# Altium project Harness_ETRX.PrjPcb
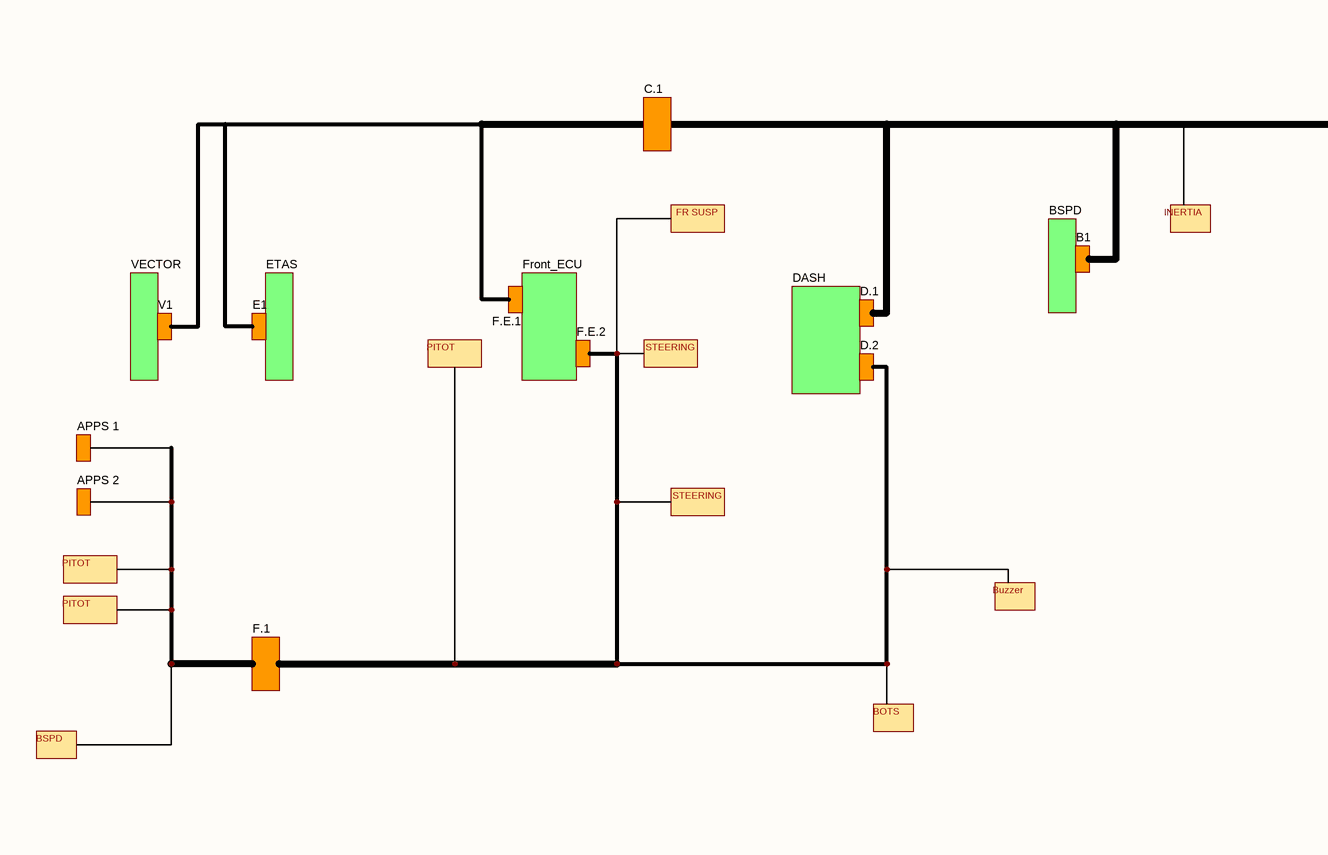
[diagram p0: Esquema_gen_ETRX.SchDoc, left]
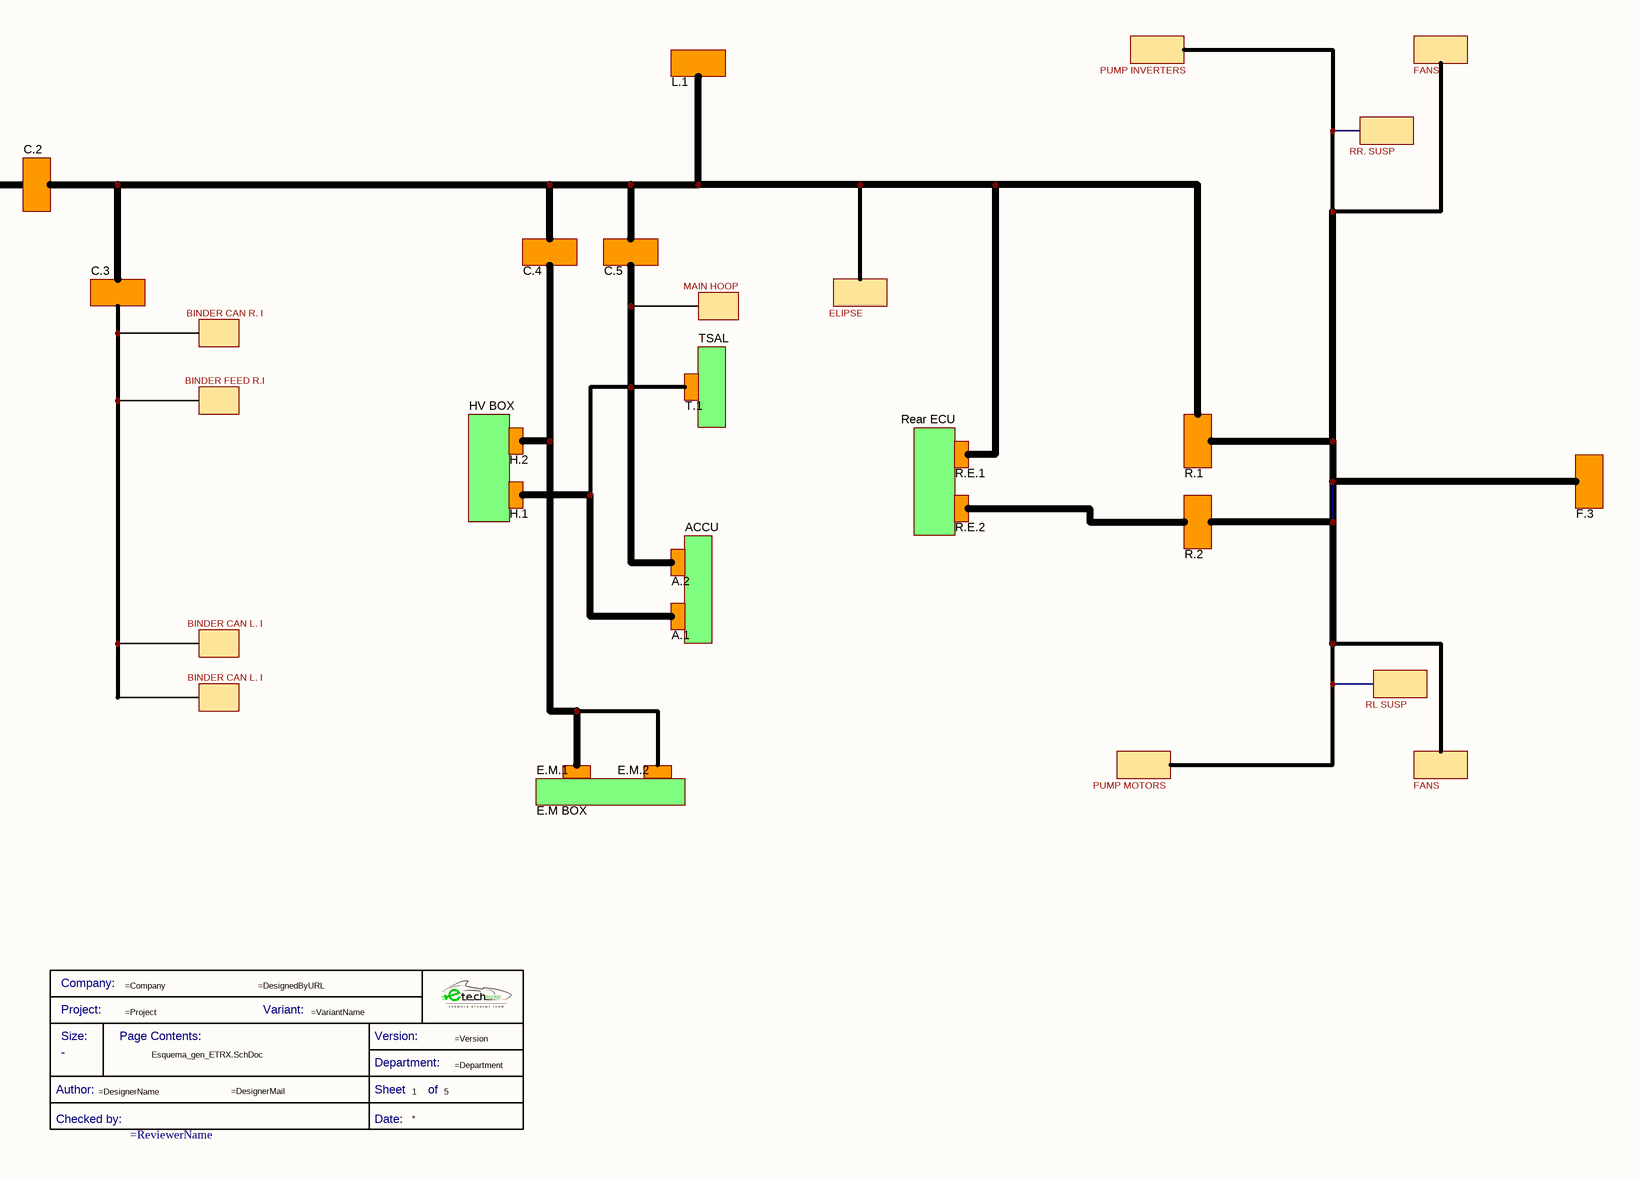
[diagram p1: Esquema_gen_ETRX.SchDoc, right]
12 sheets, 7 parts. Net scope: hierarchical (ports join the sheet entries above them; power ports are global).
Sheets:
  Esquema_gen_ETRX.SchDoc
    Jose maricon = Front_ECU.SchDoc
    Designator = Rear ECU.SchDoc
    Designator = HV BOX.SchDoc
    Designator = DASH.SchDoc
    Designator = E.M BOX.SchDoc
    Designator = ACCU.SchDoc
    Designator = ETAS.SchDoc
    Designator = VECTOR.SchDoc
    Designator = BSPD.SchDoc
  FRONT SENSORS.SchDoc
  Esquema cableado gen.SchDoc
    Designator = DASH.SchDoc
    Designator = Front_ECU.SchDoc
    Designator = ETAS.SchDoc
    Designator = HV BOX.SchDoc
    Designator = ACCU.SchDoc
    Designator = Rear ECU.SchDoc

## Sheet Esquema_gen_ETRX.SchDoc
size 599 x 241 mm; SheetNumber: 1; SheetTotal: 5

### Parts
*  Title Block_template  (value not drawn)  (graphical)

### Sub-sheets
Designator = Rear ECU: no entries
Designator = HV BOX: no entries
Designator = DASH: no entries
Designator = E.M BOX: no entries
Designator = ACCU: no entries
Designator = ETAS: no entries
Designator = VECTOR: no entries
Designator = BSPD: no entries
Designator = TSAL (file not in this document): no entries
Designator = F.E.2 (file not in this document): no entries
Designator = F.E.1 (file not in this document): no entries
Designator = V1 (file not in this document): no entries
Designator = E1 (file not in this document): no entries
Designator = B1 (file not in this document): no entries
Designator = D.1 (file not in this document): no entries
Designator = D.2 (file not in this document): no entries
Designator = APPS 1 (file not in this document): no entries
Designator = APPS 2 (file not in this document): no entries
Designator = C.1 (file not in this document): no entries
Designator = F.1 (file not in this document): no entries
Designator = C.2 (file not in this document): no entries
Designator = C.3 (file not in this document): no entries
Designator = C.4 (file not in this document): no entries
Designator = C.5 (file not in this document): no entries
Designator = H.2 (file not in this document): no entries
Designator = H.1 (file not in this document): no entries
Designator = A.2 (file not in this document): no entries
Designator = A.1 (file not in this document): no entries
Designator = T.1 (file not in this document): no entries
Designator = E.M.1 (file not in this document): no entries
Designator = E.M.2 (file not in this document): no entries
Designator = L.1 (file not in this document): no entries
Designator = R.E.1 (file not in this document): no entries
Designator = R.E.2 (file not in this document): no entries
Designator = R.1 (file not in this document): no entries
Designator = R.2 (file not in this document): no entries
Designator = F.3 (file not in this document): no entries
Jose maricon = Front_ECU: no entries

### Notes on the sheet
- PUMP INVERTERS
- FANS
- RR. SUSP
- FR SUSP
- INERTIA
- BINDER CAN R. I
- MAIN HOOP
- ELIPSE
- BINDER FEED R.I
- PITOT
- STEERING
- Buzzer
- BINDER CAN L. I
- RL SUSP
- BOTS
- PUMP MOTORS
- BSPD
- (in symbol Title Block_template) Company:; Project:; Variant:; Size:; Page Contents:; Version:; Department:; Author:; Sheet; of; Checked by:; Date:

### Library data of the parts
* = Title Block_template: Standard Title Block; .Creator: GP; Category: Title Block; .PCBcheck: GP; .SCHcheck: GP; Checked by:: =ReviewerName; Size: -

## Sheet Front_ECU.SchDoc
size A4
Used 2 times, as channels Jose maricon, Designator. Parts and nets are listed once, with the designators drawn on the sheet.
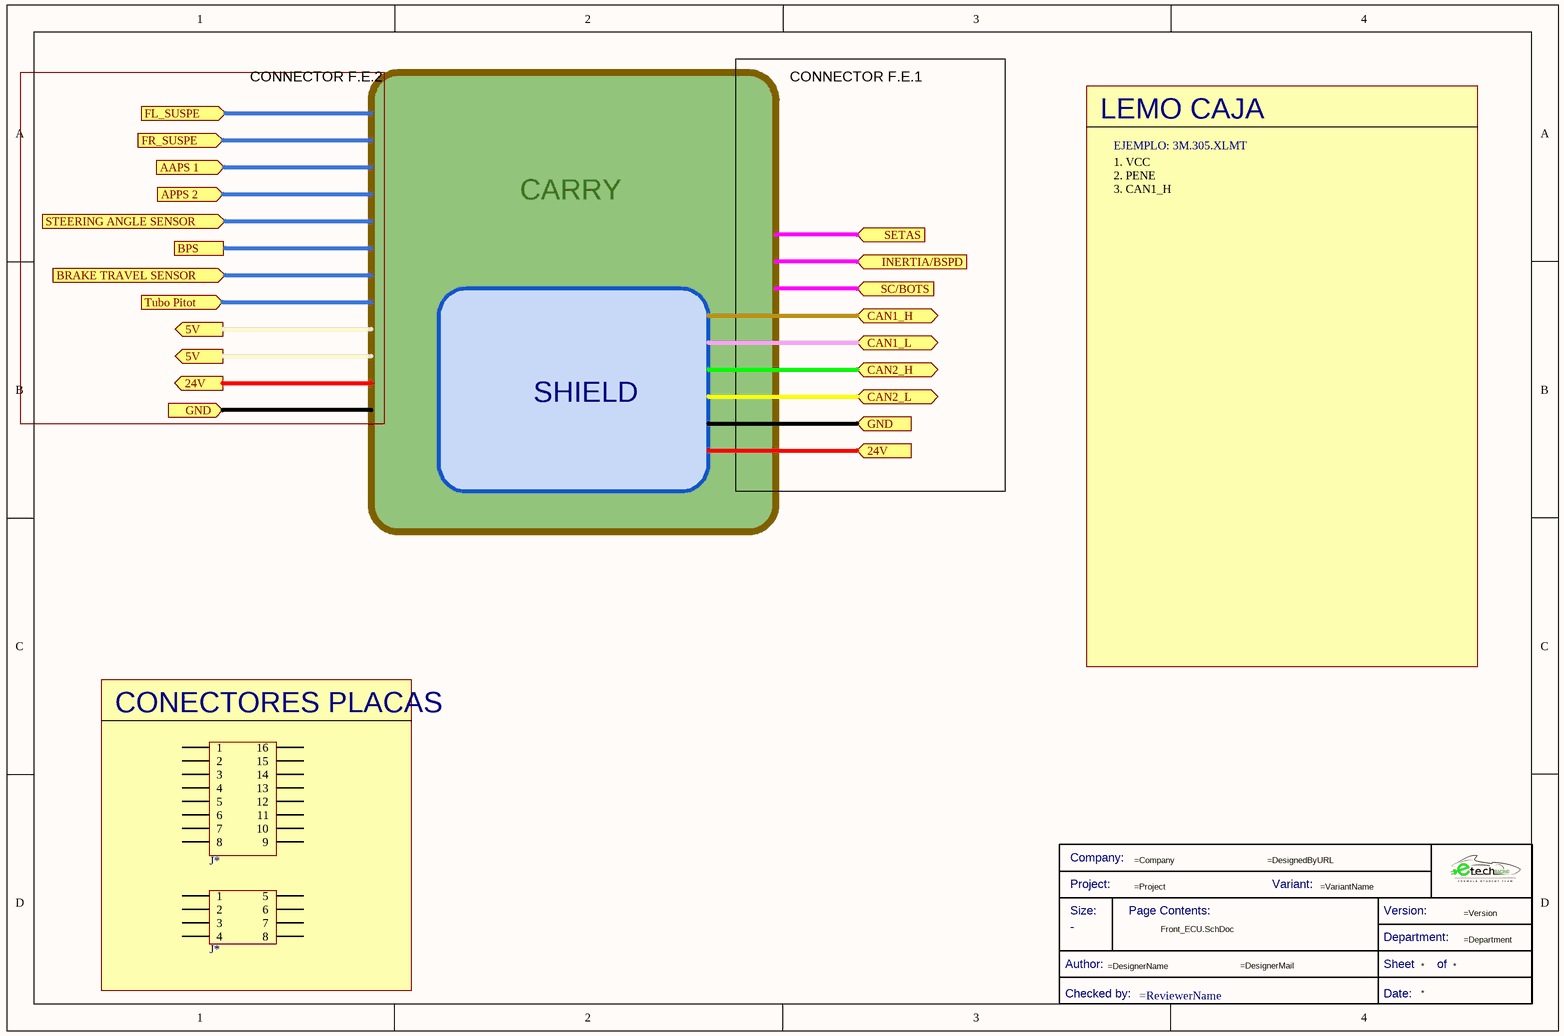
[diagram p2: Front_ECU.SchDoc]

### Parts
(Parts that share a designator on the sheet are numbered #1, #2 ... from top to bottom, then left to right.)
*?  Title Block_template  (value not drawn)  (graphical)
J*#1  1053141116  [J_NanoFit_2x8]  (value not drawn)
J*#2  0430450800  [J_MicroFit_2x4]  (value not drawn)

### Blocks framed on the sheet
CONECTORES PLACAS: J*#1 J*#2

### Ports
5V (out), 24V (in), 24V (out), AAPS 1 (in), APPS 2 (in), BPS (in), BRAKE TRAVEL SENSOR (in), CAN1_H (bidir), CAN1_L (bidir), CAN2_H (bidir), CAN2_L (bidir), FL_SUSPE (in), FR_SUSPE (in), GND (in), INERTIA/BSPD (in), SC/BOTS (in), SETAS (in), STEERING ANGLE SENSOR (in), Tubo Pitot (in)

### Nets

Not connected (* = marked no-connect by the designer): J*#1 1 2 3 4 5 6 7 8 9 10 11 12 13 14 15 16; J*#2 1 2 3 4 5 6 7 8

### Channels
Jose maricon: designators *?=*?_Jose_maricon J*=J*_Jose_maricon#1 J*=J*_Jose_maricon#2; ports 5V=open 24V=open AAPS 1=open APPS 2=open BPS=open BRAKE TRAVEL SENSOR=open CAN1_H=open CAN1_L=open CAN2_H=open CAN2_L=open FL_SUSPE=open FR_SUSPE=open GND=open INERTIA/BSPD=open SC/BOTS=open SETAS=open STEERING ANGLE SENSOR=open Tubo Pitot=open
Designator: designators *?=*?_Designator J*=J*_Designator#1 J*=J*_Designator#2; ports 5V=open 24V=open AAPS 1=open APPS 2=open BPS=open BRAKE TRAVEL SENSOR=open CAN1_H=open CAN1_L=open CAN2_H=open CAN2_L=open FL_SUSPE=open FR_SUSPE=open GND=open INERTIA/BSPD=open SC/BOTS=open SETAS=open STEERING ANGLE SENSOR=open Tubo Pitot=open

### Notes on the sheet
- CONNECTOR F.E.2
- CONNECTOR F.E.1
- LEMO CAJA
- EJEMPLO: 3M.305.XLMT
- CARRY
- 1. VCC          2. PENE        3. CAN1_H
- SHIELD
- (in symbol Title Block_template) Company:; Project:; Variant:; Size:; Page Contents:; Version:; Department:; Author:; Sheet; of; Checked by:; Date:

### Library data of the parts
*? = Title Block_template: Standard Title Block; .Creator: GP; Category: Title Block; .PCBcheck: GP; .SCHcheck: GP; Checked by:: =ReviewerName; Size: -
J*#1 = J_NanoFit_2x8: Nano-Fit Right Angle Header Through Hole 2.50mm Pitch Dual Row 16 Circuits Tin (Sn) Plating Black; Manufacturer: Molex; Manufacturer Part Number: 105314-1116; .Creator: DO; ComponentLink1URL: https://www.molex.com/pdm_docs/ps/PS-105300-100-001.pdf?src-supplier=Digi-Key; ComponentLink1Description: https://www.molex.com/pdm_docs/ps/PS-105300-100-001.pdf?src-supplier=Digi-Key; ComponentLink2Description: Where buy it; ComponentLink2URL: https://www.molex.com/molex/products/part-detail/pcb_headers/1053141116; Supplier 1: Newark; RoHS: Yes; Category: Headers and Wire Housings; Stock 1: 366; Pricing 1: 1=3,37000, 10=3,24000, 25=2,88000, 50=2,81000, 100=2,73000, 250=2,44000 (USD); Supplier Part Number 1: 33AC7692
J*#2 = J_MicroFit_2x4: Connector Wire to Board Header 8 Position 3mm Solder Right Angle Thru-Hole Tray; Manufacturer 1: Molex; .Creator: GP; Supplier 1: Arrow Electronics; Manufacturer Part Number 1: 0430450800; RoHS: Yes; Category: Headers and Wire Housings; Stock 1: 47494; Pricing 1: 1=2,57150, 10=2,34190, 25=2,14460, 50=2,00330, 100=1,89490, 500=1,75400 (USD); Supplier Part Number 1: 43045-0800

## Sheet Rear ECU.SchDoc
size A4
Used 2 times, as channels Designator, Designator. Parts and nets are listed once, with the designators drawn on the sheet.
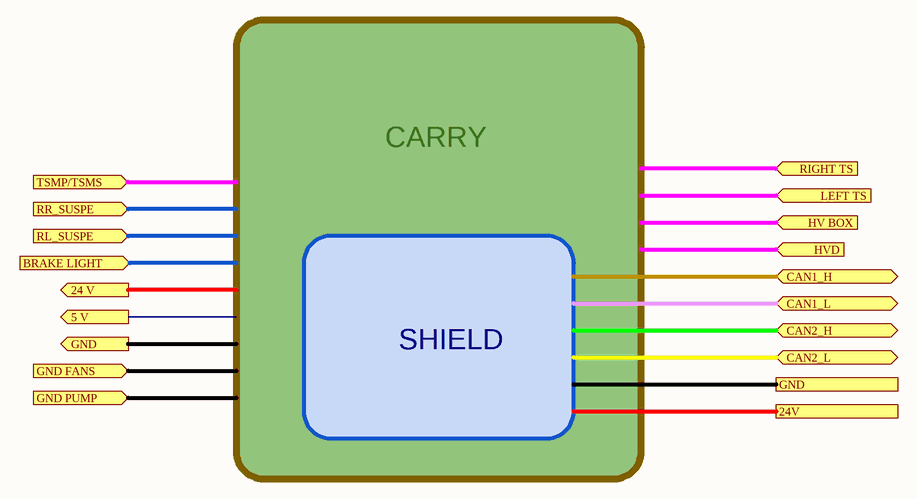
[diagram p3: Rear ECU.SchDoc]

### Ports
5 V (out), 24 V (out), 24V, BRAKE LIGHT (in), CAN1_H (bidir), CAN1_L (bidir), CAN2_H (bidir), CAN2_L (bidir), GND, GND (out), GND FANS (in), GND PUMP (in), HV BOX (in), HVD (in), LEFT TS (in), RIGHT TS (in), RL_SUSPE (in), RR_SUSPE (in), TSMP/TSMS (in)

### Channels
Designator: ports 5 V=open 24 V=open 24V=open BRAKE LIGHT=open CAN1_H=open CAN1_L=open CAN2_H=open CAN2_L=open GND FANS=open GND PUMP=open GND=open HV BOX=open HVD=open LEFT TS=open RIGHT TS=open RL_SUSPE=open RR_SUSPE=open TSMP/TSMS=open
Designator: ports 5 V=open 24 V=open 24V=open BRAKE LIGHT=open CAN1_H=open CAN1_L=open CAN2_H=open CAN2_L=open GND FANS=open GND PUMP=open GND=open HV BOX=open HVD=open LEFT TS=open RIGHT TS=open RL_SUSPE=open RR_SUSPE=open TSMP/TSMS=open

### Notes on the sheet
- CARRY
- SHIELD

## Sheet HV BOX.SchDoc
size 381 x 241 mm
Used 2 times, as channels Designator, Designator. Parts and nets are listed once, with the designators drawn on the sheet.
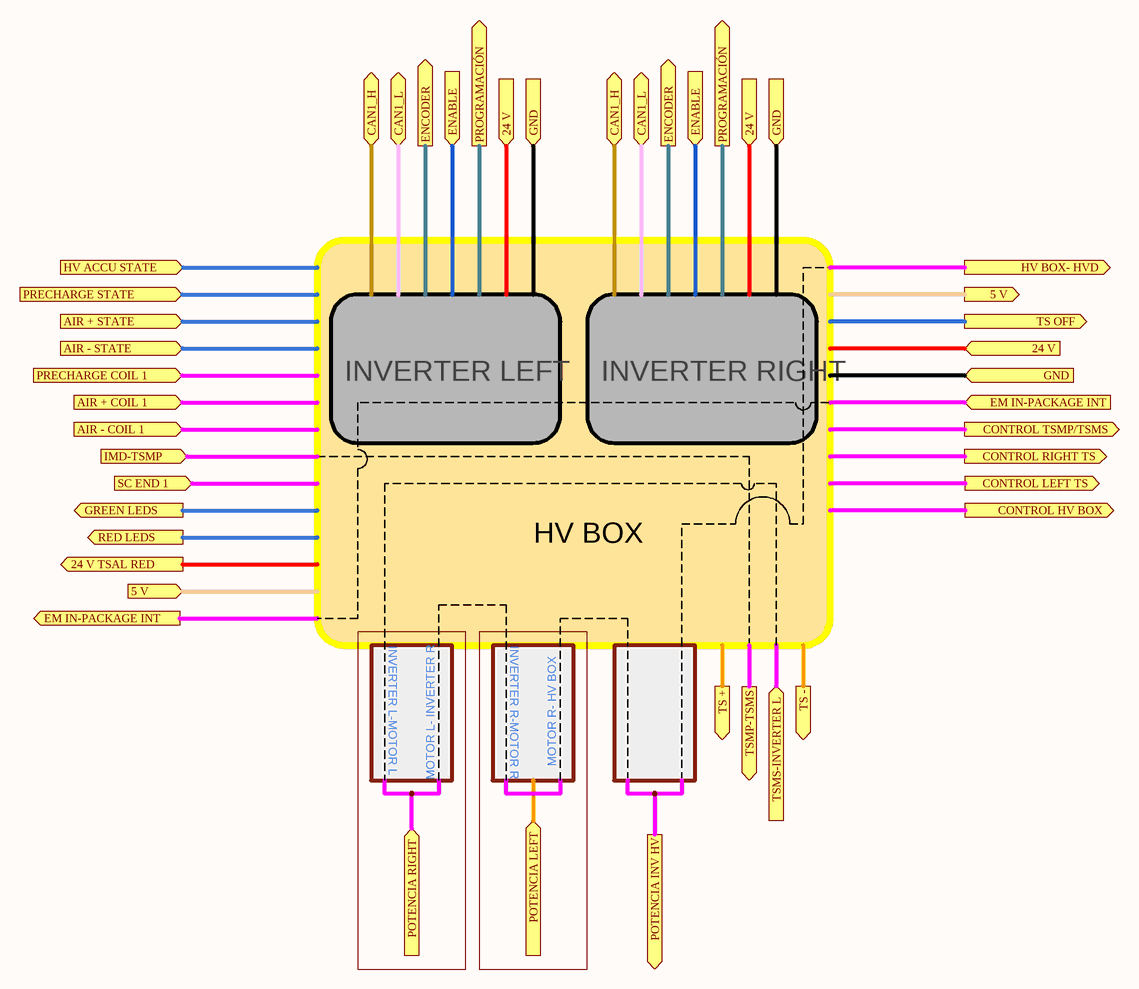
[diagram p4: HV BOX.SchDoc]

### Ports
5 V (in), 5 V (out), 24 V (in), 24 V TSAL RED (out), AIR + COIL 1 (in), AIR + STATE (in), AIR - COIL 1 (in), AIR - STATE (in), CAN1_H (bidir), CAN1_L (bidir), CONTROL HV BOX (out), CONTROL LEFT TS (out), CONTROL RIGHT TS (out), CONTROL TSMP/TSMS (out), EM IN-PACKAGE INT (in), EM IN-PACKAGE INT (out), ENABLE (in), ENCODER (out), GND (in), GREEN LEDS (out), HV ACCU STATE (in), HV BOX- HVD (out), IMD-TSMP (in), POTENCIA INV HV (out), POTENCIA LEFT (in), POTENCIA RIGHT (in), PRECHARGE COIL 1 (in), PRECHARGE STATE (in), PROGRAMACIÓN (out), RED LEDS (out), SC END 1 (in), TS + (out), TS - (out), TS OFF (out), TSMP-TSMS (out), TSMS-INVERTER L (in)

### Channels
Designator: ports 5 V=open 24 V TSAL RED=open 24 V=open AIR + COIL 1=open AIR + STATE=open AIR - COIL 1=open AIR - STATE=open CAN1_H=open CAN1_L=open CONTROL HV BOX=open CONTROL LEFT TS=open CONTROL RIGHT TS=open CONTROL TSMP/TSMS=open EM IN-PACKAGE INT=open ENABLE=open ENCODER=open GND=open GREEN LEDS=open HV ACCU STATE=open HV BOX- HVD=open IMD-TSMP=open POTENCIA INV HV=open POTENCIA LEFT=open POTENCIA RIGHT=open PRECHARGE COIL 1=open PRECHARGE STATE=open PROGRAMACIÓN=open RED LEDS=open SC END 1=open TS +=open TS -=open TS OFF=open TSMP-TSMS=open TSMS-INVERTER L=open
Designator: ports 5 V=open 24 V TSAL RED=open 24 V=open AIR + COIL 1=open AIR + STATE=open AIR - COIL 1=open AIR - STATE=open CAN1_H=open CAN1_L=open CONTROL HV BOX=open CONTROL LEFT TS=open CONTROL RIGHT TS=open CONTROL TSMP/TSMS=open EM IN-PACKAGE INT=open ENABLE=open ENCODER=open GND=open GREEN LEDS=open HV ACCU STATE=open HV BOX- HVD=open IMD-TSMP=open POTENCIA INV HV=open POTENCIA LEFT=open POTENCIA RIGHT=open PRECHARGE COIL 1=open PRECHARGE STATE=open PROGRAMACIÓN=open RED LEDS=open SC END 1=open TS +=open TS -=open TS OFF=open TSMP-TSMS=open TSMS-INVERTER L=open

### Notes on the sheet
- INVERTER LEFT
- INVERTER RIGHT
- HV BOX
- INVERTER L-MOTOR L
- INVERTER R-MOTOR R
- MOTOR R- HV BOX
- MOTOR L- INVERTER R

## Sheet DASH.SchDoc
size A4
Used 2 times, as channels Designator, Designator. Parts and nets are listed once, with the designators drawn on the sheet.
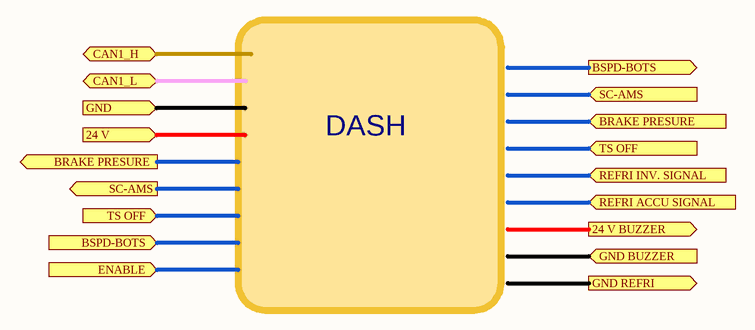
[diagram p5: DASH.SchDoc]

### Ports
24 V (in), 24 V BUZZER (out), BRAKE PRESURE  (in), BRAKE PRESURE  (out), BSPD-BOTS (in), BSPD-BOTS (out), CAN1_H (bidir), CAN1_L (bidir), ENABLE (in), GND (in), GND BUZZER (in), GND REFRI (out), REFRI ACCU SIGNAL (in), REFRI INV. SIGNAL (in), SC-AMS (in), SC-AMS (out), TS OFF (in)

### Channels
Designator: ports 24 V BUZZER=open 24 V=open BRAKE PRESURE =open BSPD-BOTS=open CAN1_H=open CAN1_L=open ENABLE=open GND BUZZER=open GND REFRI=open GND=open REFRI ACCU SIGNAL=open REFRI INV. SIGNAL=open SC-AMS=open TS OFF=open
Designator: ports 24 V BUZZER=open 24 V=open BRAKE PRESURE =open BSPD-BOTS=open CAN1_H=open CAN1_L=open ENABLE=open GND BUZZER=open GND REFRI=open GND=open REFRI ACCU SIGNAL=open REFRI INV. SIGNAL=open SC-AMS=open TS OFF=open

### Notes on the sheet
- DASH

## Sheet E.M BOX.SchDoc
size A4; SheetNumber: 5; SheetTotal: 6
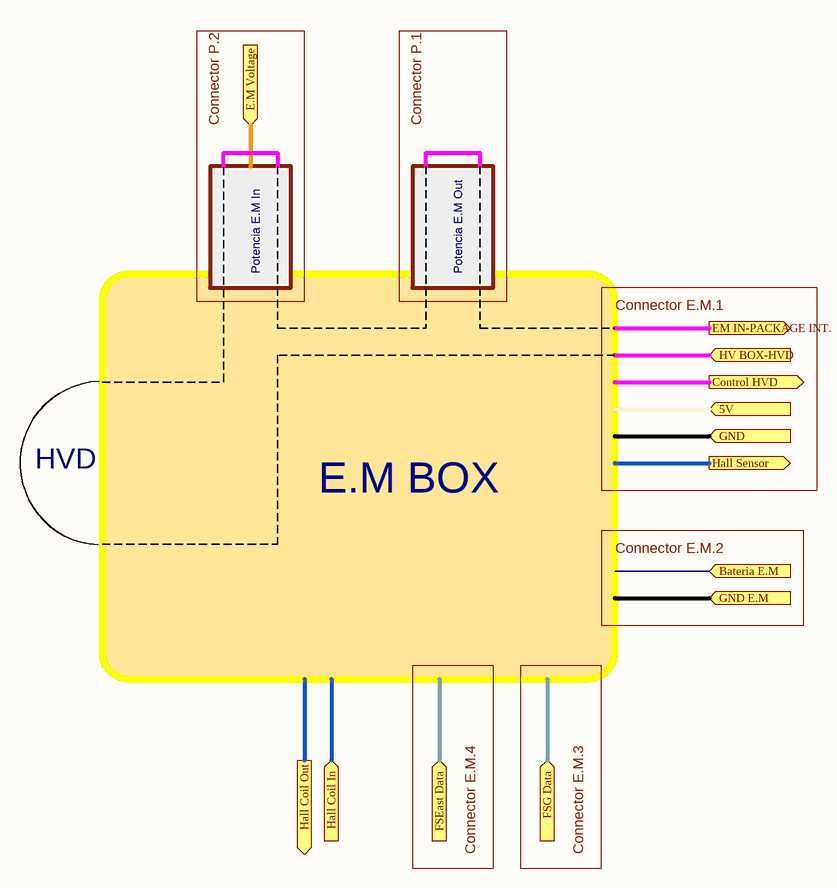
[diagram p6: E.M BOX.SchDoc]

### Ports
5V (in), Bateria E.M (in), Control HVD (out), E.M Voltage (in), EM IN-PACKAGE INT. (out), FSEast Data (in), FSG Data (in), GND (in), GND E.M (in), Hall Coil In (in), Hall Coil Out (out), Hall Sensor (out), HV BOX-HVD (in)

### Notes on the sheet
- Connector P.2
- Connector P.1
- Potencia E.M In
- Potencia E.M Out
- Connector E.M.1
- HVD
- E.M BOX
- Connector E.M.2
- Connector E.M.4
- Connector E.M.3

## Sheet ACCU.SchDoc
size A2
Used 2 times, as channels Designator, Designator. Parts and nets are listed once, with the designators drawn on the sheet.
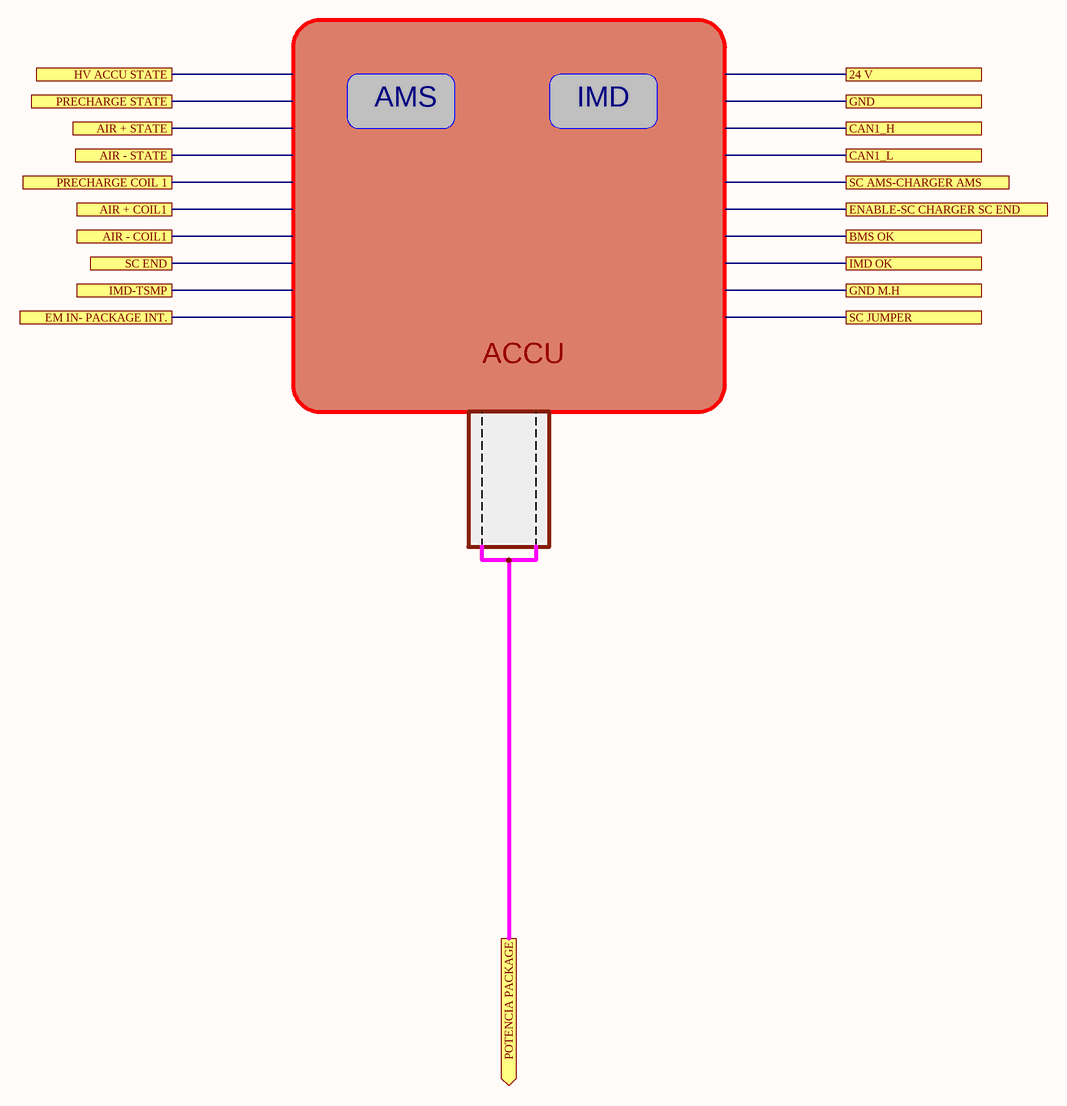
[diagram p7: ACCU.SchDoc]

### Ports
24 V, AIR + COIL1, AIR + STATE, AIR - COIL1, AIR - STATE, BMS OK, CAN1_H, CAN1_L, EM IN- PACKAGE INT., ENABLE-SC CHARGER SC END, GND, GND M.H, HV ACCU STATE, IMD OK, IMD-TSMP, POTENCIA PACKAGE (out), PRECHARGE COIL 1, PRECHARGE STATE, SC AMS-CHARGER AMS, SC END, SC JUMPER

### Channels
Designator: ports 24 V=open AIR + COIL1=open AIR + STATE=open AIR - COIL1=open AIR - STATE=open BMS OK=open CAN1_H=open CAN1_L=open EM IN- PACKAGE INT.=open ENABLE-SC CHARGER SC END=open GND M.H=open GND=open HV ACCU STATE=open IMD OK=open IMD-TSMP=open POTENCIA PACKAGE=open PRECHARGE COIL 1=open PRECHARGE STATE=open SC AMS-CHARGER AMS=open SC END=open SC JUMPER=open
Designator: ports 24 V=open AIR + COIL1=open AIR + STATE=open AIR - COIL1=open AIR - STATE=open BMS OK=open CAN1_H=open CAN1_L=open EM IN- PACKAGE INT.=open ENABLE-SC CHARGER SC END=open GND M.H=open GND=open HV ACCU STATE=open IMD OK=open IMD-TSMP=open POTENCIA PACKAGE=open PRECHARGE COIL 1=open PRECHARGE STATE=open SC AMS-CHARGER AMS=open SC END=open SC JUMPER=open

### Notes on the sheet
- AMS
- IMD
- ACCU

## Sheet ETAS.SchDoc
size A4
Used 2 times, as channels Designator, Designator. Parts and nets are listed once, with the designators drawn on the sheet.
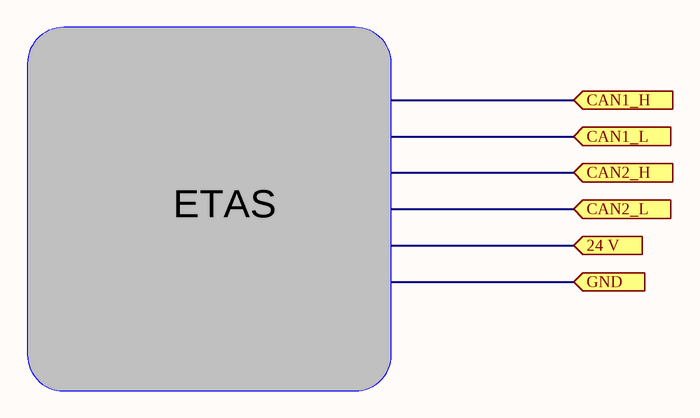
[diagram p8: ETAS.SchDoc]

### Ports
24 V (in, see BSPD[3B], DASH[1B], HV BOX[2A], HV BOX[3B], Rear ECU[1B], VECTOR[3B]), CAN1_H (in, see DASH[1B], Front_ECU[3B], HV BOX[2A], Rear ECU[3B], VECTOR[3B]), CAN1_L (in, see DASH[1B], Front_ECU[3B], HV BOX[2A], Rear ECU[3B], VECTOR[3B]), CAN2_H (in, see Front_ECU[3B], Rear ECU[3B], VECTOR[3B]), CAN2_L (in, see Front_ECU[3B], Rear ECU[3B], VECTOR[3B]), GND (in, see BSPD[3B], DASH[1B], E.M BOX[3B], Front_ECU[3B], HV BOX[2A], HV BOX[3A], HV BOX[3B], Rear ECU[1B], Rear ECU[3B], VECTOR[3C])

### Channels
Designator: ports 24 V=open CAN1_H=open CAN1_L=open CAN2_H=open CAN2_L=open GND=open
Designator: ports 24 V=open CAN1_H=open CAN1_L=open CAN2_H=open CAN2_L=open GND=open

### Notes on the sheet
- ETAS

## Sheet VECTOR.SchDoc
size A4
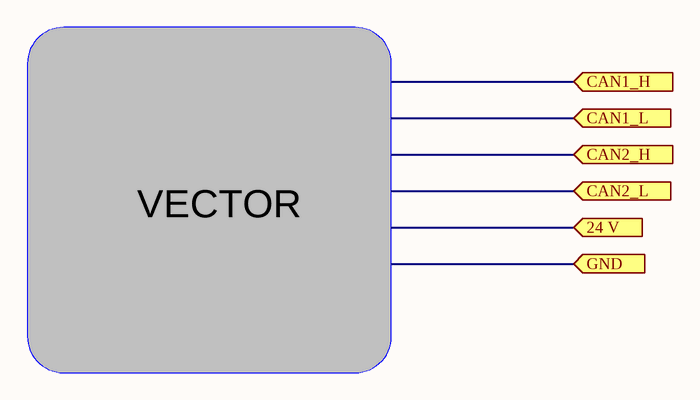
[diagram p9: VECTOR.SchDoc]

### Ports
24 V (in), CAN1_H (in), CAN1_L (in), CAN2_H (in), CAN2_L (in), GND (in)

### Notes on the sheet
- VECTOR

## Sheet BSPD.SchDoc
size A4
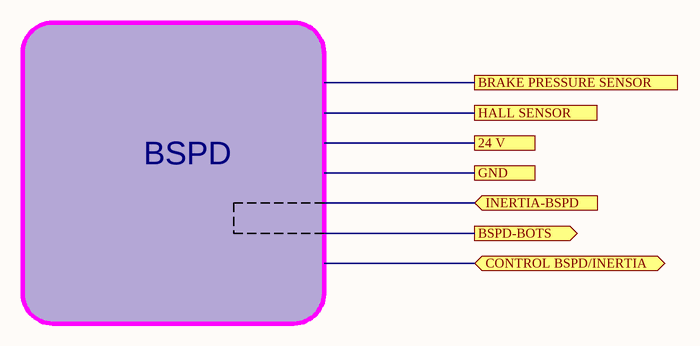
[diagram p10: BSPD.SchDoc]

### Ports
24 V, BRAKE PRESSURE SENSOR, BSPD-BOTS (out), CONTROL BSPD/INERTIA (bidir), GND, HALL SENSOR, INERTIA-BSPD (in)

### Notes on the sheet
- BSPD

## Sheet FRONT SENSORS.SchDoc
size A2
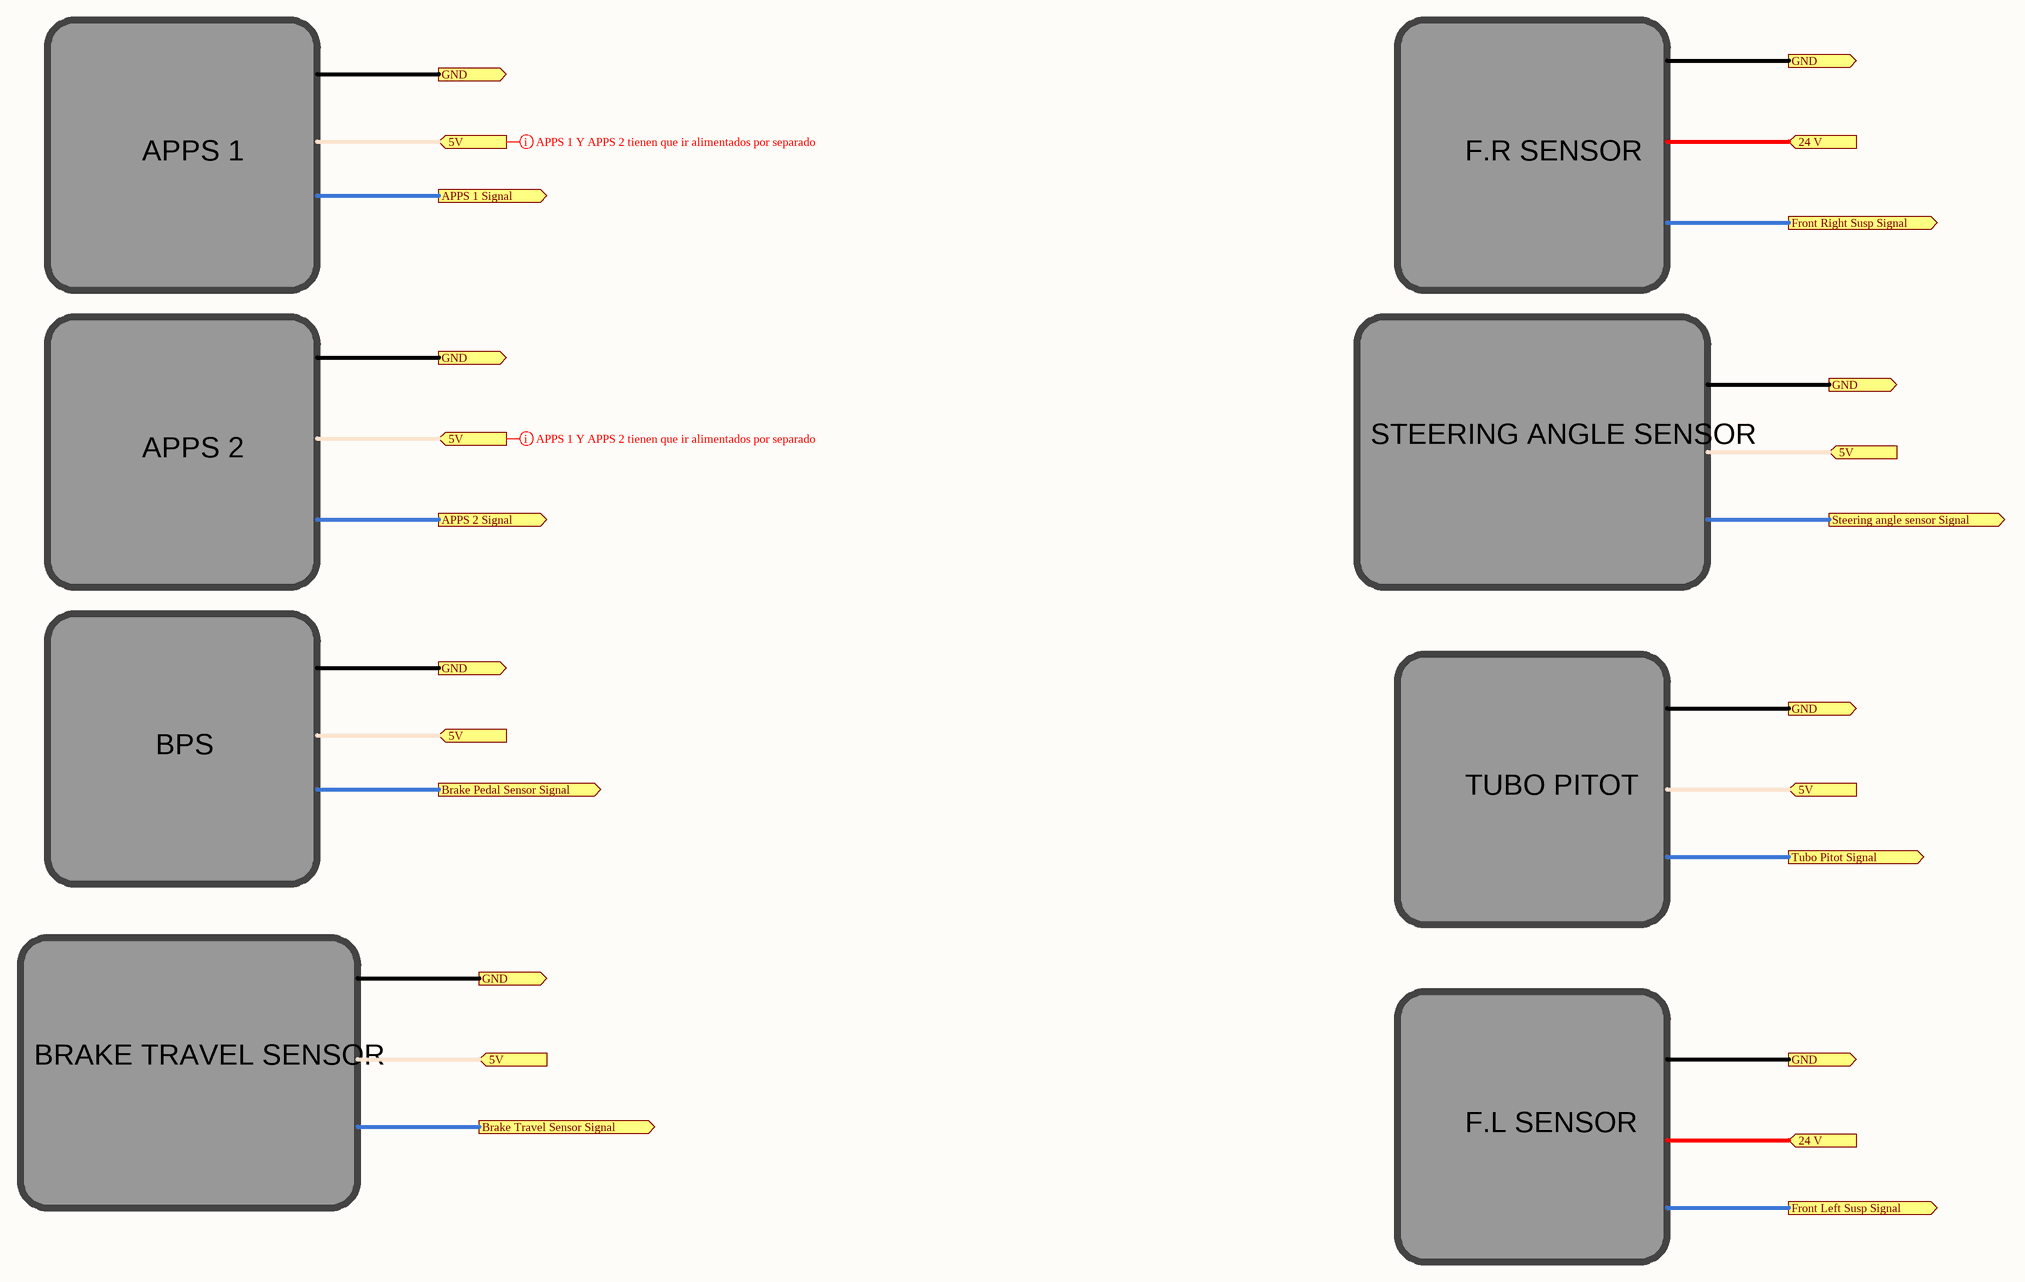
[diagram p11: FRONT SENSORS.SchDoc]

### Ports
5V (in), 24 V (in), APPS 1 Signal (out), APPS 2 Signal (out), Brake Pedal Sensor Signal (out), Brake Travel Sensor Signal (out), Front Left Susp Signal (out), Front Right Susp Signal (out), GND (out), Steering angle sensor Signal (out), Tubo Pitot Signal (out)

### Layout directives
mark named APPS 1 Y APPS 2 tienen que ir alimentados por separado: (no net found under the mark)

### Notes on the sheet
- APPS 1
- F.R SENSOR
- STEERING ANGLE SENSOR
- APPS 2
- BPS
- TUBO PITOT
- BRAKE TRAVEL SENSOR
- F.L SENSOR

## Sheet Esquema cableado gen.SchDoc
size A1
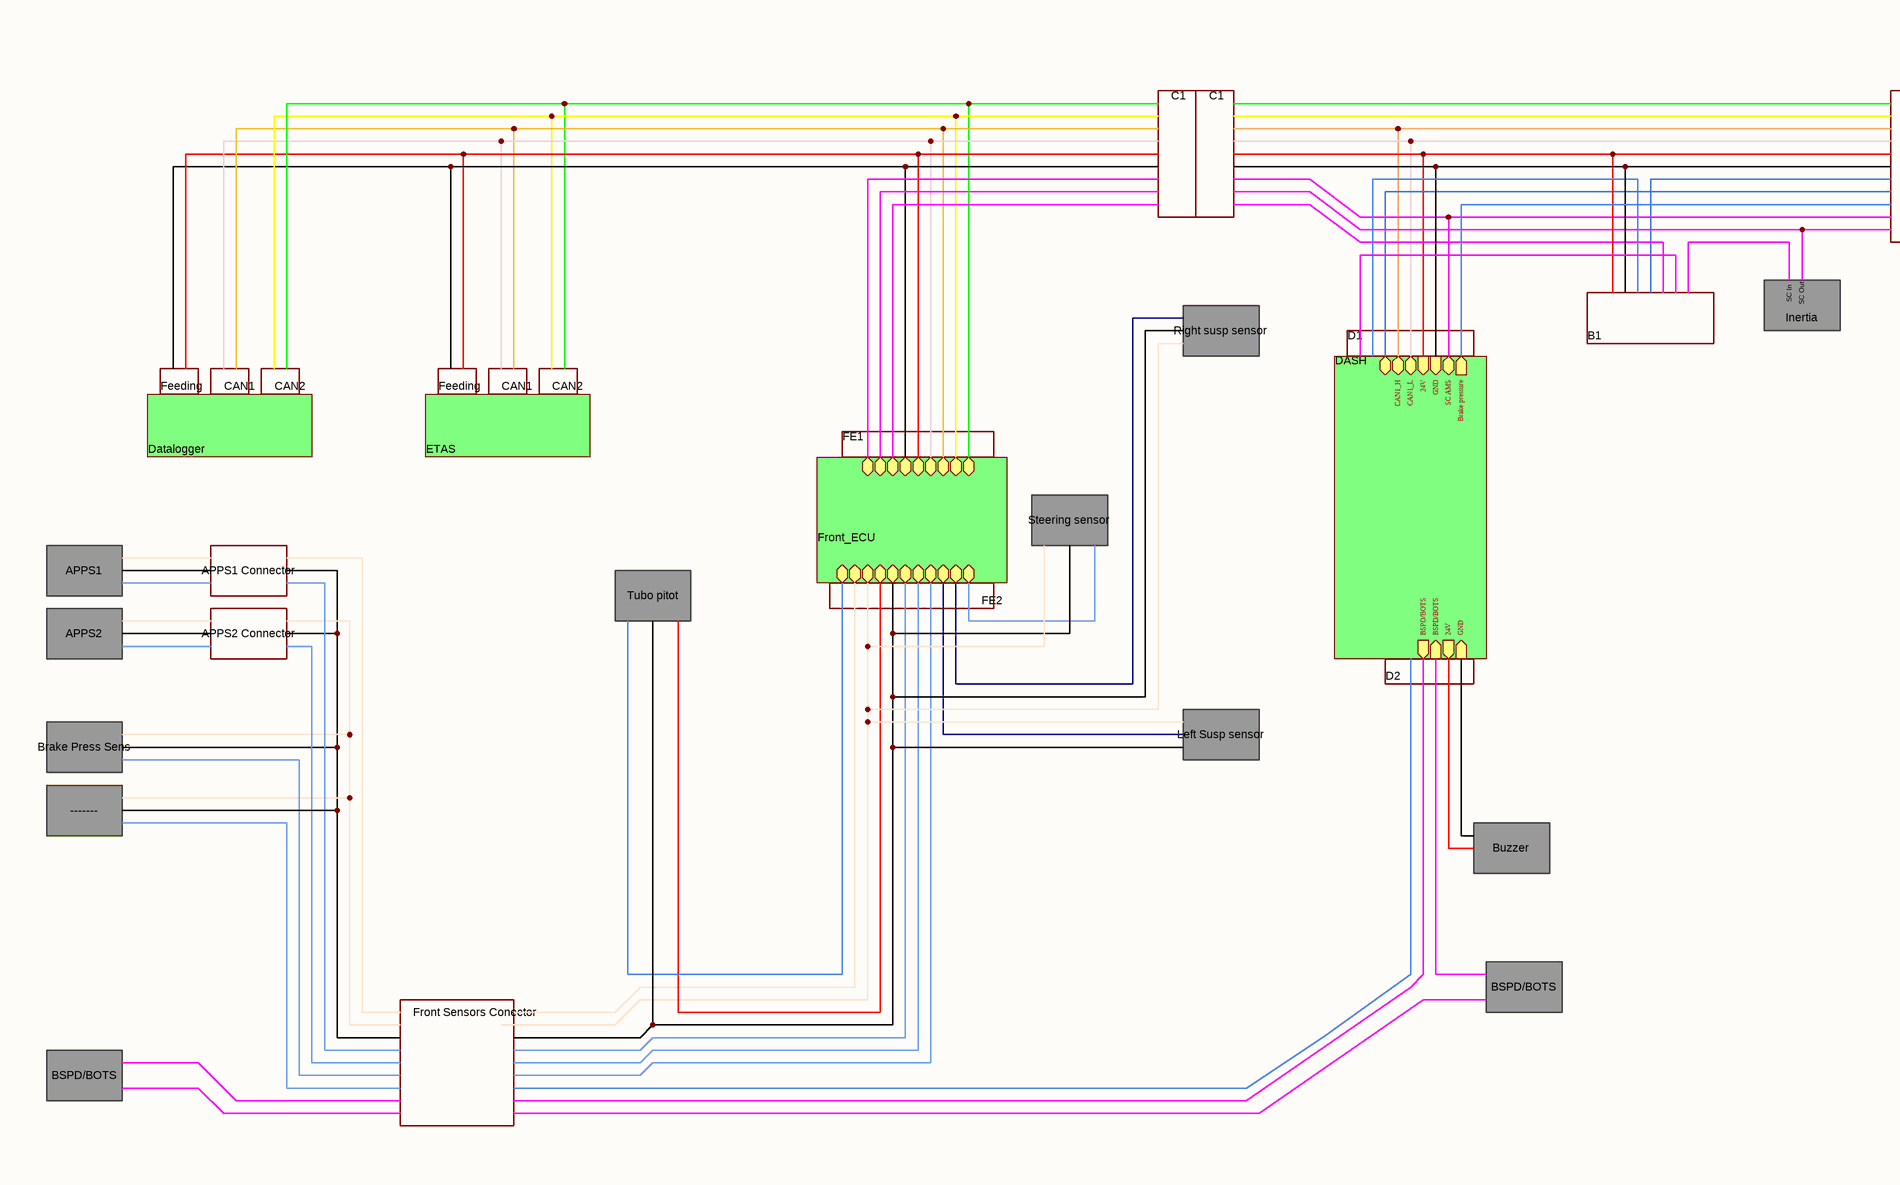
[diagram p12: Esquema cableado gen.SchDoc, left]
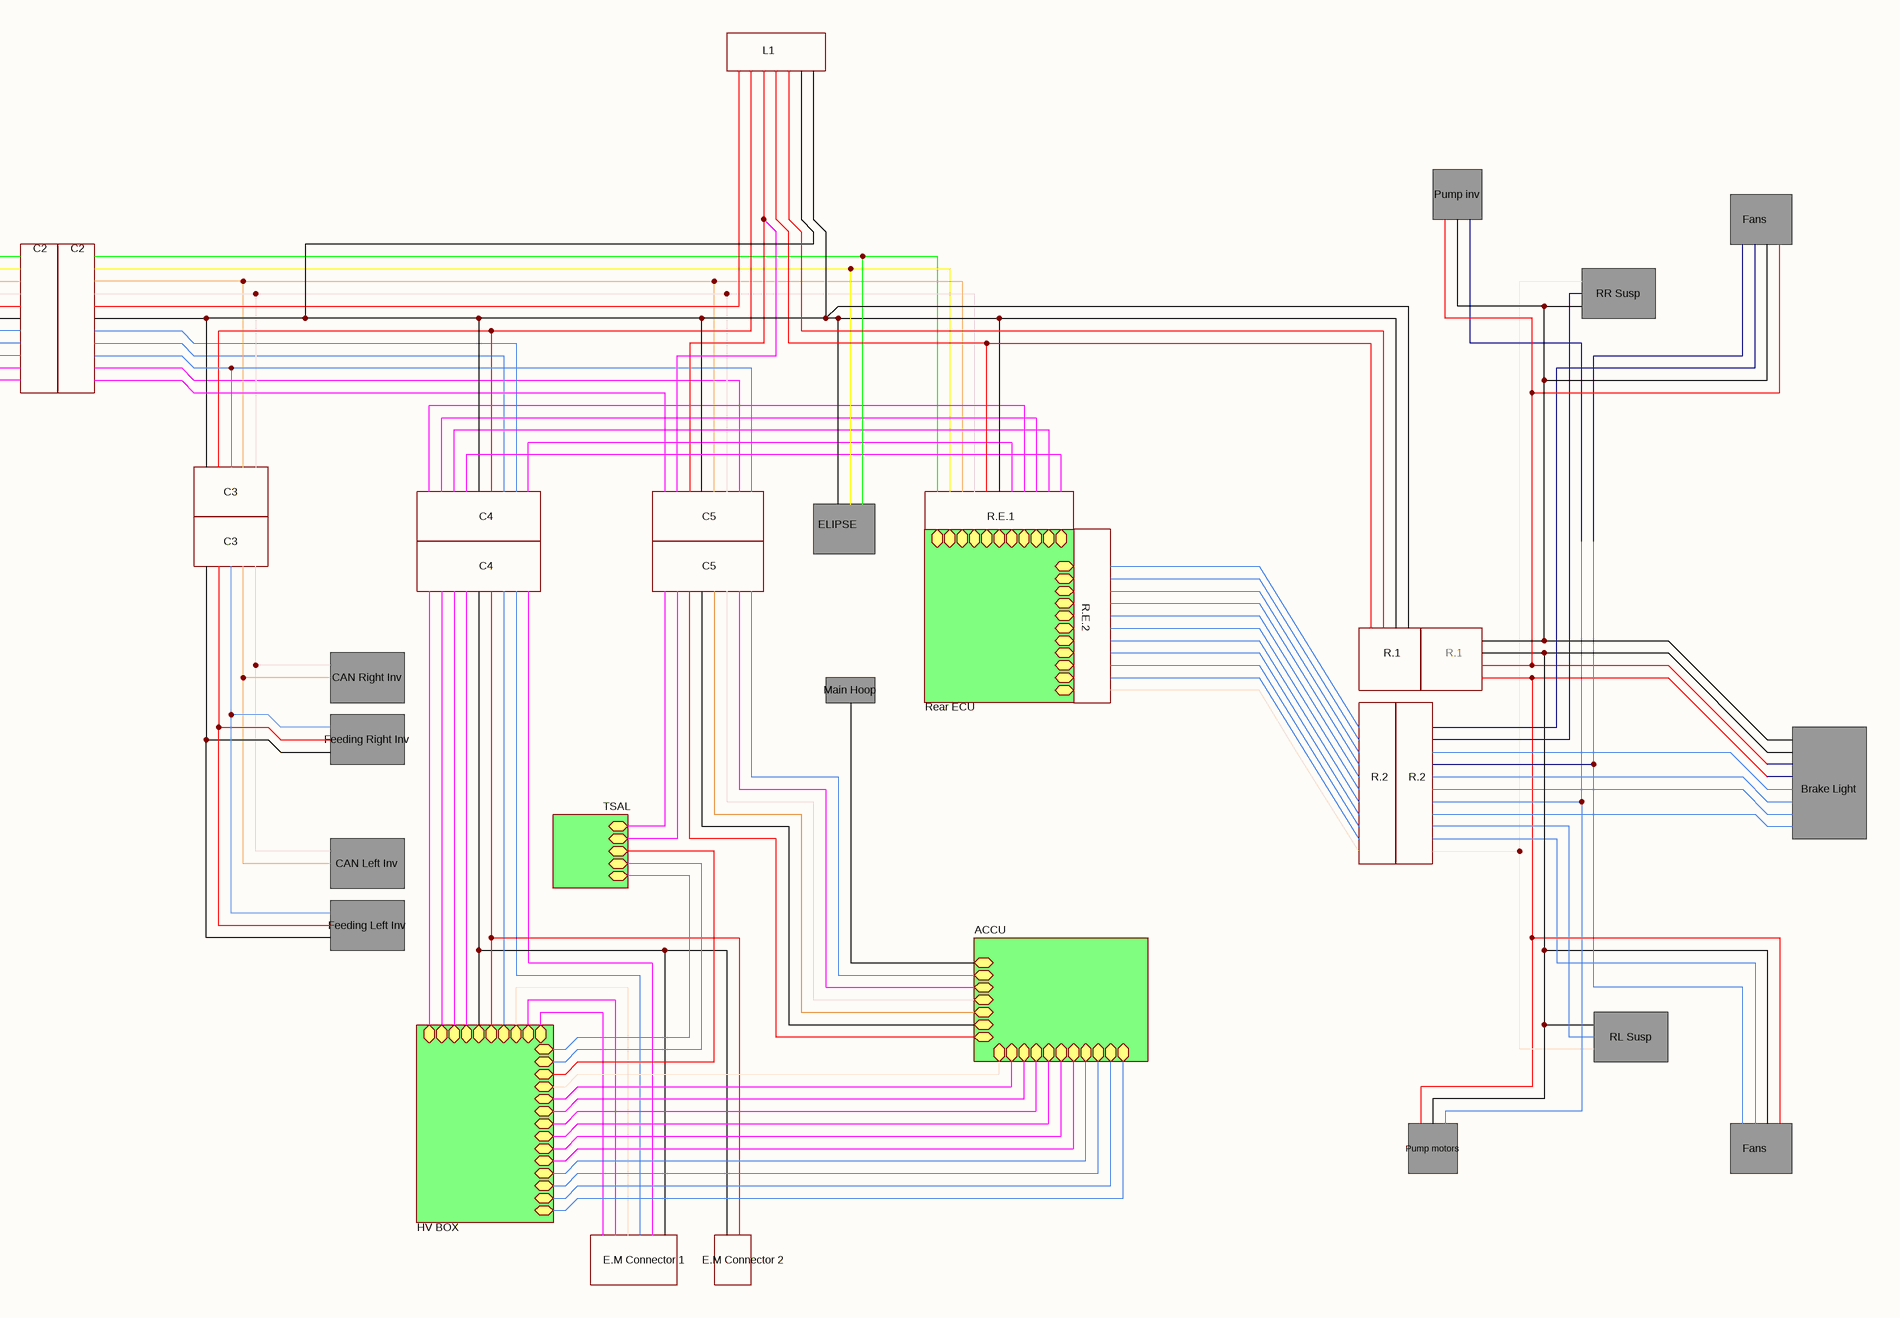
[diagram p13: Esquema cableado gen.SchDoc, right]

### Sub-sheets
Designator = DASH: CAN1_H (bidir), CAN1_L (bidir), 24V (in), GND (in), Brake pressure (out), SC AMS (bidir), GND (in), 24V (out), BSPD/BOTS (in), BSPD/BOTS (out),  (bidir)
Designator = Front_ECU:  (bidir),  (bidir),  (bidir),  (bidir),  (bidir),  (bidir),  (bidir),  (bidir),  (bidir),  (bidir),  (bidir),  (bidir),  (bidir),  (bidir),  (bidir),  (bidir),  (bidir),  (bidir),  (bidir),  (bidir)
Designator = Datalogger (file not in this document): no entries
Designator = ETAS: no entries
Designator = HV BOX:  (bidir),  (bidir),  (bidir),  (bidir),  (bidir),  (bidir),  (bidir),  (bidir),  (bidir),  (bidir),  (bidir),  (bidir),  (bidir),  (bidir),  (bidir),  (bidir),  (bidir),  (bidir),  (bidir),  (bidir),  (bidir),  (bidir),  (bidir),  (bidir)
Designator = TSAL (file not in this document):  (bidir),  (bidir),  (bidir),  (bidir),  (bidir)
Designator = ACCU:  (bidir),  (bidir),  (bidir),  (bidir),  (bidir),  (bidir),  (bidir),  (bidir),  (bidir),  (bidir),  (bidir),  (bidir),  (bidir),  (bidir),  (bidir),  (bidir),  (bidir),  (bidir)
Designator = Rear ECU:  (bidir),  (bidir),  (bidir),  (bidir),  (bidir),  (bidir),  (bidir),  (bidir),  (bidir),  (bidir),  (bidir),  (bidir),  (bidir),  (bidir),  (bidir),  (bidir),  (bidir),  (bidir),  (bidir),  (bidir),  (bidir),  (bidir)

### Nets
(unnamed): sheet Designator/24V, sheet Designator/24V
(unnamed): sheet Designator/GND, sheet Designator/GND
(unnamed): sheet Designator/BSPD/BOTS, sheet Designator/BSPD/BOTS
(unnamed): sheet Designator/, sheet Designator/, sheet Designator/, sheet Designator/, sheet Designator/, sheet Designator/, sheet Designator/, sheet Designator/, sheet Designator/, sheet Designator/, sheet Designator/, sheet Designator/, sheet Designator/, sheet Designator/, sheet Designator/, sheet Designator/, sheet Designator/, sheet Designator/, sheet Designator/, sheet Designator/
(unnamed): sheet Designator/, sheet Designator/, sheet Designator/, sheet Designator/, sheet Designator/, sheet Designator/, sheet Designator/, sheet Designator/, sheet Designator/, sheet Designator/, sheet Designator/, sheet Designator/, sheet Designator/, sheet Designator/, sheet Designator/, sheet Designator/, sheet Designator/, sheet Designator/, sheet Designator/, sheet Designator/, sheet Designator/, sheet Designator/, sheet Designator/, sheet Designator/, sheet Designator/, sheet Designator/, sheet Designator/, sheet Designator/, sheet Designator/, sheet Designator/, sheet Designator/, sheet Designator/, sheet Designator/, sheet Designator/, sheet Designator/, sheet Designator/, sheet Designator/, sheet Designator/, sheet Designator/, sheet Designator/, sheet Designator/, sheet Designator/, sheet Designator/, sheet Designator/, sheet Designator/
(unnamed): sheet Designator/, sheet Designator/, sheet Designator/, sheet Designator/, sheet Designator/, sheet Designator/, sheet Designator/, sheet Designator/, sheet Designator/, sheet Designator/, sheet Designator/, sheet Designator/, sheet Designator/, sheet Designator/, sheet Designator/, sheet Designator/, sheet Designator/, sheet Designator/, sheet Designator/, sheet Designator/, sheet Designator/, sheet Designator/

### Notes on the sheet
- L1
- Pump inv
- C1
- C2
- Fans
- RR Susp
- SC In
- SC Out
- Right susp sensor
- D1
- B1
- Inertia
- C3
- Feeding
- CAN1
- CAN2
- C4
- C5
- ELIPSE
- R.E.1
- FE1
- R.E.2
- Steering sensor
- CAN Right Inv
- Main Hoop
- R.1
- APPS1
- APPS1 Connector
- Tubo pitot
- FE2
- Feeding Right Inv
- APPS2
- APPS2 Connector
- R.2
- Brake Light
- Left Susp sensor
- D2
- CAN Left Inv
- Brake Press Sens
- Feeding Left Inv
- -------
- Buzzer
- RL Susp
- BSPD/BOTS
- Front Sensors Conector
- Pump motors
- E.M Connector 1
- E.M Connector 2
- Title
- Size:
- Date:
- File:
- A1
- Number:
- Time:
- Revision:
- Sheet
- of